# Altium schematic sheet MB_Control.SchDoc
size 420 x 297 mm; Date: 04/03/2023; ApprovedBy: UA3REO; CheckedBy: UA3REO; Author: RU4PN; CompanyName: Wolf Team; DocumentNumber: Wolf2 MainBoard Control; SheetNumber: 7; SheetTotal: 7
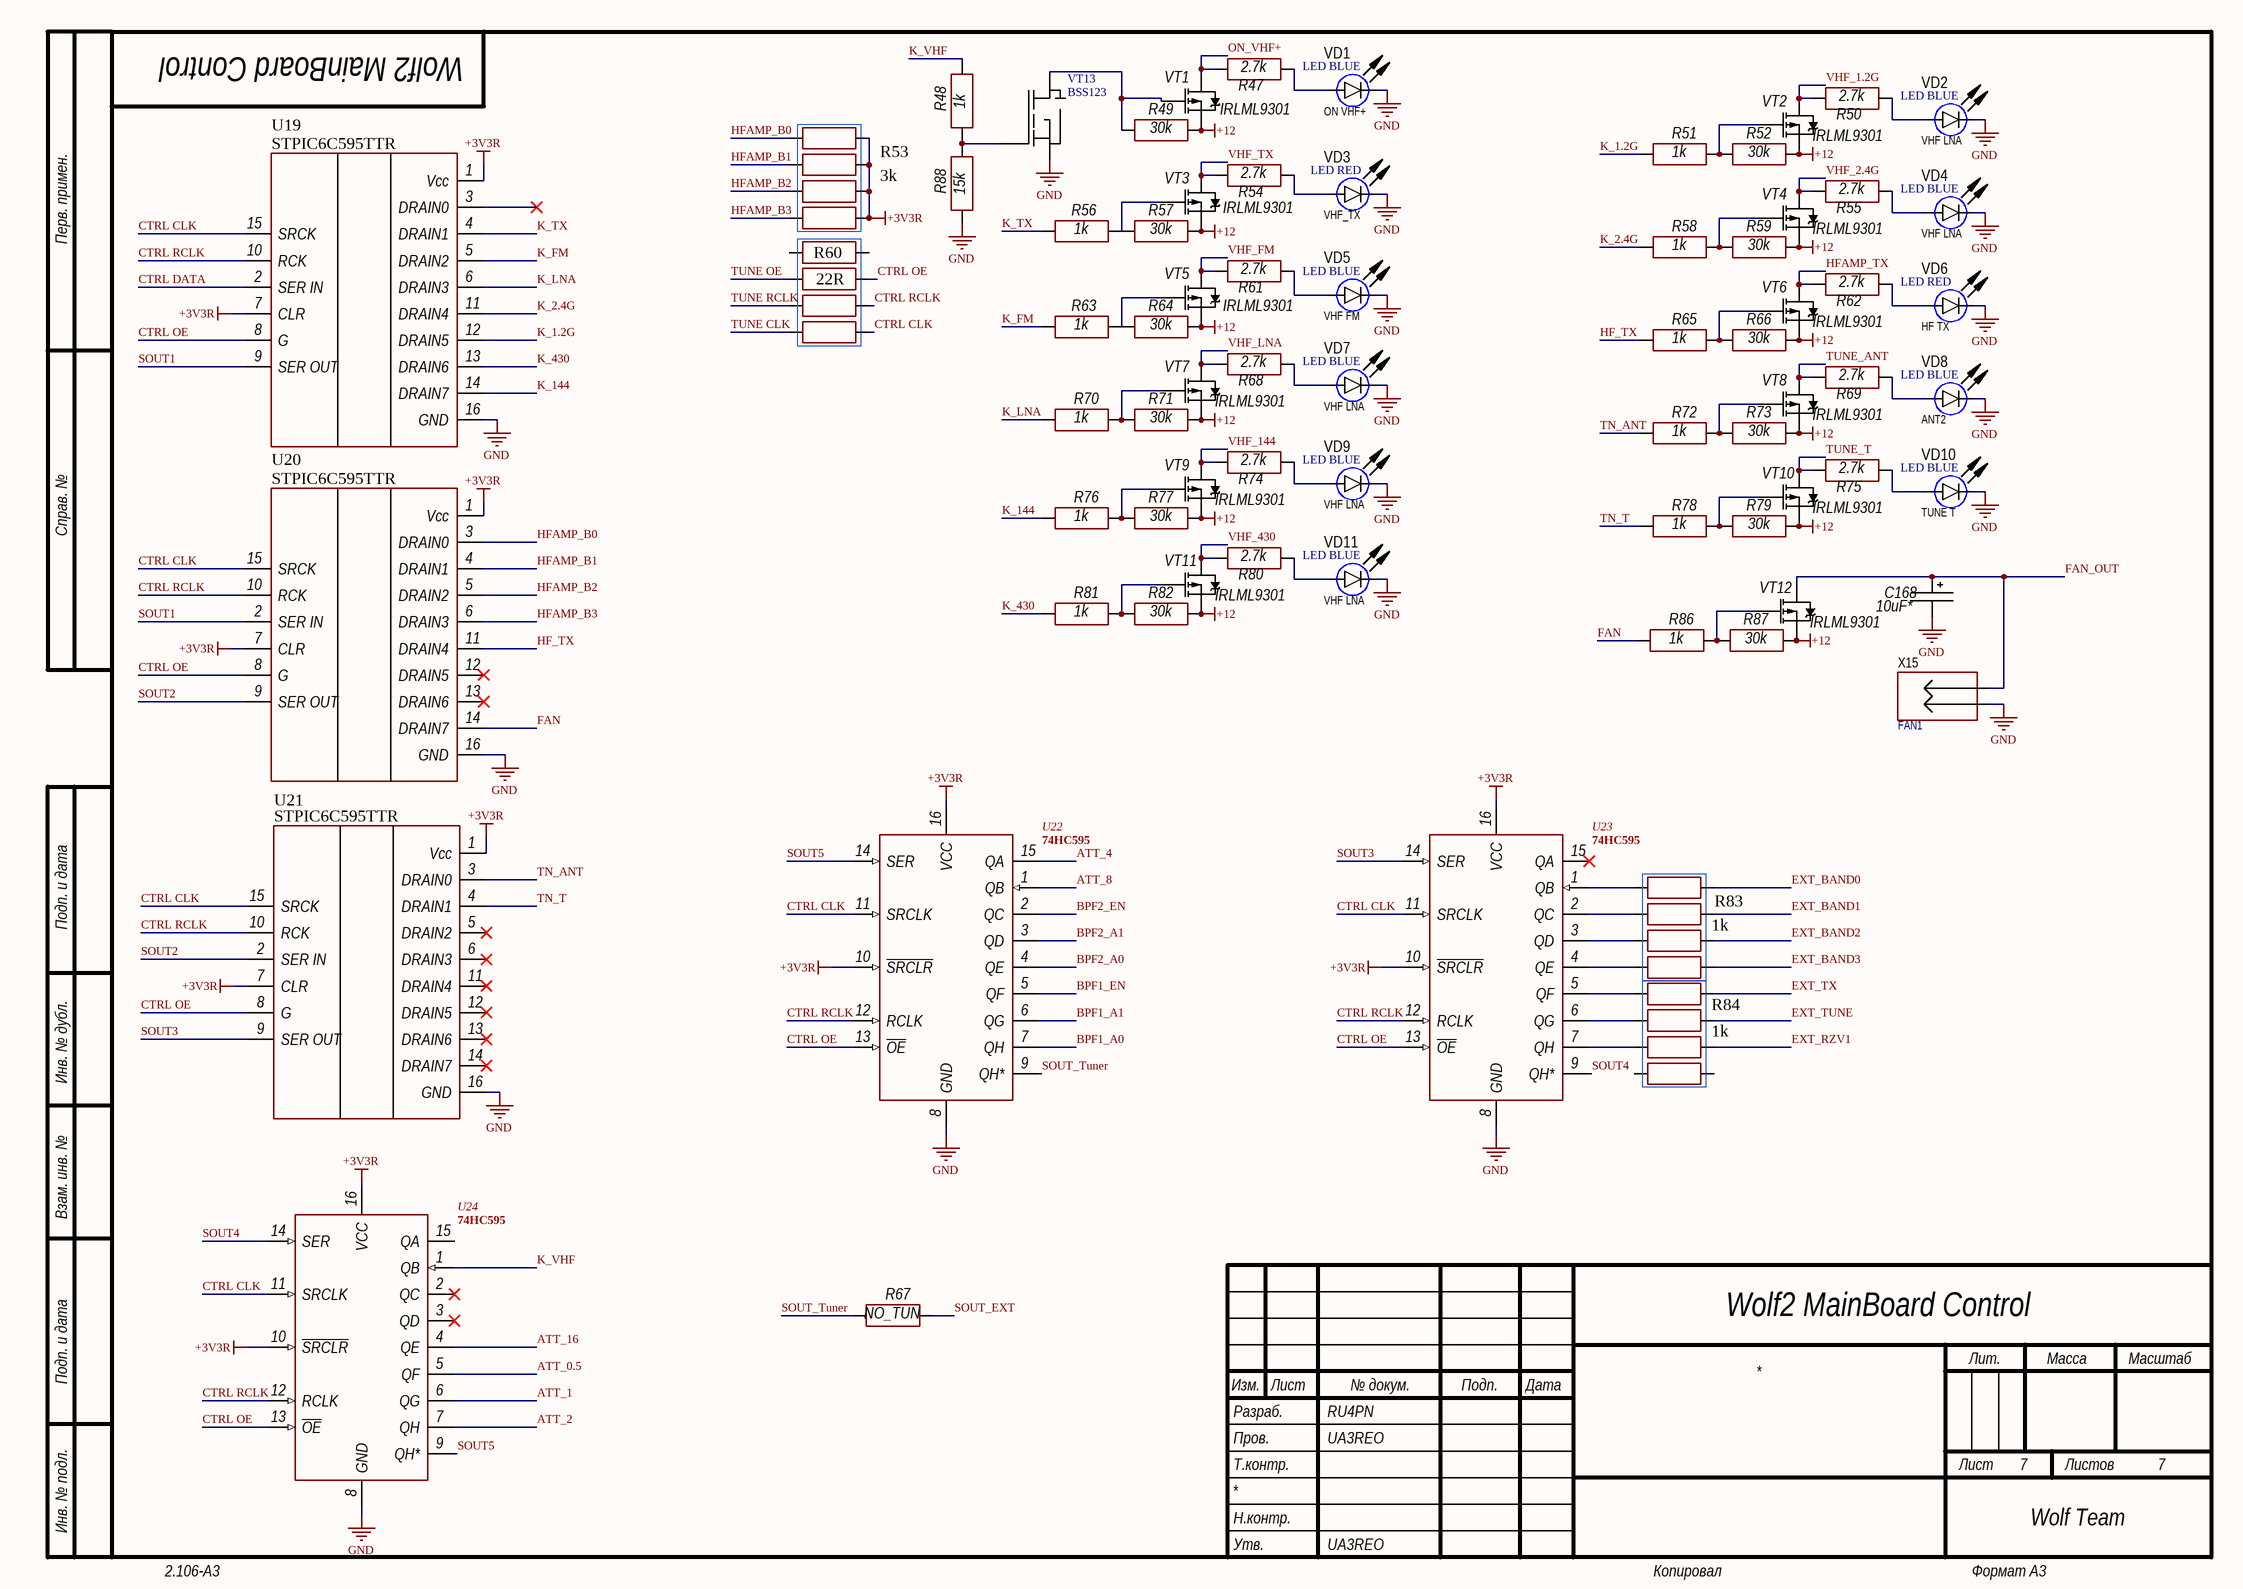
[diagram p0: MB_Control.SchDoc]

## Parts
C168  10uF*  [TANTAL_B]
R47  2.7k  [CH0805R]
R48  1k  [CH0805R]
R49  30k  [CH0805R]
R50  2.7k  [CH0805R]
R51  1k  [CH0805R]
R52  30k  [CH0805R]
R53  3k  [CAT16]
R54  2.7k  [CH0805R]
R55  2.7k  [CH0805R]
R56  1k  [CH0805R]
R57  30k  [CH0805R]
R58  1k  [CH0805R]
R59  30k  [CH0805R]
R60  22R  [CAT16]
R61  2.7k  [CH0805R]
R62  2.7k  [CH0805R]
R63  1k  [CH0805R]
R64  30k  [CH0805R]
R65  1k  [CH0805R]
R66  30k  [CH0805R]
R67  NO_TUN  [CH0805R]
R68  2.7k  [CH0805R]
R69  2.7k  [CH0805R]
R70  1k  [CH0805R]
R71  30k  [CH0805R]
R72  1k  [CH0805R]
R73  30k  [CH0805R]
R74  2.7k  [CH0805R]
R75  2.7k  [CH0805R]
R76  1k  [CH0805R]
R77  30k  [CH0805R]
R78  1k  [CH0805R]
R79  30k  [CH0805R]
R80  2.7k  [CH0805R]
R81  1k  [CH0805R]
R82  30k  [CH0805R]
R83  1k  [CAT16]
R84  1k  [CAT16]
R86  1k  [CH0805R]
R87  30k  [CH0805R]
R88  15k  [CH0805R]
U19  STPIC6C595TTR  [16-TSOP]
U20  STPIC6C595TTR  [16-TSOP]
U21  STPIC6C595TTR  [16-TSOP]
U22  74HC595  [16-SO]
U23  74HC595  [16-SO]
U24  74HC595  [16-SO]
VD1  LED BLUE  Color: ON VHF+  [LED: 0805B]
VD2  LED BLUE  Color: VHF LNA  [LED: 0805B]
VD3  LED RED  Color: VHF_TX  [LED: 0805R]
VD4  LED BLUE  Color: VHF LNA  [LED: 0805B]
VD5  LED BLUE  Color: VHF FM  [LED: 0805B]
VD6  LED RED  Color: HF TX  [LED: 0805R]
VD7  LED BLUE  Color: VHF LNA  [LED: 0805B]
VD8  LED BLUE  Color: ANT2  [LED: 0805B]
VD9  LED BLUE  Color: VHF LNA  [LED: 0805B]
VD10  LED BLUE  Color: TUNE T  [LED: 0805B]
VD11  LED BLUE  Color: VHF LNA  [LED: 0805B]
VT1  IRLML9301  [SOT23_132]
VT2  IRLML9301  [SOT23_132]
VT3  IRLML9301  [SOT23_132]
VT4  IRLML9301  [SOT23_132]
VT5  IRLML9301  [SOT23_132]
VT6  IRLML9301  [SOT23_132]
VT7  IRLML9301  [SOT23_132]
VT8  IRLML9301  [SOT23_132]
VT9  IRLML9301  [SOT23_132]
VT10  IRLML9301  [SOT23_132]
VT11  IRLML9301  [SOT23_132]
VT12  IRLML9301  [SOT23_132]
VT13  BSS123  [SOT23_132]
X15  FAN1  [CON: CWF-2]

## Nets
+3V3R: R53.5 R53.6 R53.7 R53.8 U19.1(Vcc) U19.7(CLR) U20.1(Vcc) U20.7(CLR) U21.1(Vcc) U21.7(CLR) U22.10(~{SRCLR}) U22.16(VCC) U23.10(~{SRCLR}) U23.16(VCC) U24.10(~{SRCLR}) U24.16(VCC)
+12: R49.1 R52.1 R57.1 R59.1 R64.1 R66.1 R71.1 R73.1 R77.1 R79.1 R82.1 R87.1 VT1.2(S) VT2.2(S) VT3.2(S) VT4.2(S) VT5.2(S) VT6.2(S) VT7.2(S) VT8.2(S) VT9.2(S) VT10.2(S) VT11.2(S) VT12.2(S)
GND: C168.2 R88.2 U19.16(GND) U20.16(GND) U21.16(GND) U22.8(GND) U23.8(GND) U24.8(GND) VD1.2(C) VD2.2(C) VD3.2(C) VD4.2(C) VD5.2(C) VD6.2(C) VD7.2(C) VD8.2(C) VD9.2(C) VD10.2(C) VD11.2(C) VT13.2(S) X15.2
ATT_0.5: U24.5(QF)
ATT_1: U24.6(QG)
ATT_2: U24.7(QH)
ATT_4: U22.15(QA)
ATT_8: U22.1(QB)
ATT_16: U24.4(QE)
BPF1_A0: U22.7(QH)
BPF1_A1: U22.6(QG)
BPF1_EN: U22.5(QF)
BPF2_A0: U22.4(QE)
BPF2_A1: U22.3(QD)
BPF2_EN: U22.2(QC)
CTRL CLK: R60.8 U19.15(SRCK) U20.15(SRCK) U21.15(SRCK) U22.11(SRCLK) U23.11(SRCLK) U24.11(SRCLK)
CTRL DATA: U19.2(SER_IN)
CTRL OE: R60.6 U19.8(G) U20.8(G) U21.8(G) U22.13(~{OE}) U23.13(~{OE}) U24.13(~{OE})
CTRL RCLK: R60.7 U19.10(RCK) U20.10(RCK) U21.10(RCK) U22.12(RCLK) U23.12(RCLK) U24.12(RCLK)
EXT_BAND0: R83.5
EXT_BAND1: R83.6
EXT_BAND2: R83.7
EXT_BAND3: R83.8
EXT_RZV1: R84.7
EXT_TUNE: R84.6
EXT_TX: R84.5
FAN: R86.2 U20.14(DRAIN7)
FAN_OUT: C168.1 VT12.3(D) X15.1
HF_TX: R65.2 U20.11(DRAIN4)
HFAMP_B0: R53.1 U20.3(DRAIN0)
HFAMP_B1: R53.2 U20.4(DRAIN1)
HFAMP_B2: R53.3 U20.5(DRAIN2)
HFAMP_B3: R53.4 U20.6(DRAIN3)
HFAMP_TX: R62.2 VT6.3(D)
K_1.2G: R51.2 U19.12(DRAIN5)
K_2.4G: R58.2 U19.11(DRAIN4)
K_144: R76.2 U19.14(DRAIN7)
K_430: R81.2 U19.13(DRAIN6)
K_FM: R63.2 U19.5(DRAIN2)
K_LNA: R70.2 U19.6(DRAIN3)
K_TX: R56.2 U19.4(DRAIN1)
K_VHF: R48.1 U24.1(QB)
ON_VHF+: R47.2 VT1.3(D)
SOUT1: U19.9(SER_OUT) U20.2(SER_IN)
SOUT2: U20.9(SER_OUT) U21.2(SER_IN)
SOUT3: U21.9(SER_OUT) U23.14(SER)
SOUT4: U23.9(QH*) U24.14(SER)
SOUT5: U22.14(SER) U24.9(QH*)
SOUT_EXT: R67.1
SOUT_Tuner: R67.2 U22.9(QH*)
TN_ANT: R72.2 U21.3(DRAIN0)
TN_T: R78.2 U21.4(DRAIN1)
TUNE CLK: R60.4
TUNE OE: R60.2
TUNE RCLK: R60.3
TUNE_ANT: R69.2 VT8.3(D)
TUNE_T: R75.2 VT10.3(D)
VHF_1.2G: R50.2 VT2.3(D)
VHF_2.4G: R55.2 VT4.3(D)
VHF_144: R74.2 VT9.3(D)
VHF_430: R80.2 VT11.3(D)
VHF_FM: R61.2 VT5.3(D)
VHF_LNA: R68.2 VT7.3(D)
VHF_TX: R54.2 VT3.3(D)
NetR47_1: R47.1 VD1.1(A)
NetR48_2: R48.2 R88.1 VT13.1(G)
NetR49_2: R49.2 VT1.1(G) VT13.3(D)
NetR50_1: R50.1 VD2.1(A)
NetR51_1: R51.1 R52.2 VT2.1(G)
NetR54_1: R54.1 VD3.1(A)
NetR55_1: R55.1 VD4.1(A)
NetR56_1: R56.1 R57.2 VT3.1(G)
NetR58_1: R58.1 R59.2 VT4.1(G)
NetR61_1: R61.1 VD5.1(A)
NetR62_1: R62.1 VD6.1(A)
NetR63_1: R63.1 R64.2 VT5.1(G)
NetR65_1: R65.1 R66.2 VT6.1(G)
NetR68_1: R68.1 VD7.1(A)
NetR69_1: R69.1 VD8.1(A)
NetR70_1: R70.1 R71.2 VT7.1(G)
NetR72_1: R72.1 R73.2 VT8.1(G)
NetR74_1: R74.1 VD9.1(A)
NetR75_1: R75.1 VD10.1(A)
NetR76_1: R76.1 R77.2 VT9.1(G)
NetR78_1: R78.1 R79.2 VT10.1(G)
NetR80_1: R80.1 VD11.1(A)
NetR81_1: R81.1 R82.2 VT11.1(G)
NetR83_1: R83.1 U23.1(QB)
NetR83_2: R83.2 U23.2(QC)
NetR83_3: R83.3 U23.3(QD)
NetR83_4: R83.4 U23.4(QE)
NetR84_1: R84.1 U23.5(QF)
NetR84_2: R84.2 U23.6(QG)
NetR84_3: R84.3 U23.7(QH)
NetR86_1: R86.1 R87.2 VT12.1(G)

Not connected (* = marked no-connect by the designer): R60 1 5; R84 4 8; U19 3(DRAIN0)*; U20 12(DRAIN5)* 13(DRAIN6)*; U21 5(DRAIN2)* 6(DRAIN3)* 11(DRAIN4)* 12(DRAIN5)* 13(DRAIN6)* 14(DRAIN7)*; U23 15(QA)*; U24 2(QC)* 3(QD)* 15(QA)

## Notes on the sheet
- Перв. примен.
- Справ. №
- Подп. и дата
- Инв. № дубл.
- Взам. инв. №
- Разраб.
- Изм.
- Лист
- № докум.
- Подп.
- Дата
- Лит.
- Масса
- Масштаб
- Пров.
- Т.контр.
- Листов
- Инв. № подл.
- Утв.
- Н.контр.
- 2.106-A3
- Копировал
- Формат А3

## Library data of the parts
C168 = TantalCap: Manufacturer: *; Model: *; HelpURL: *; ComponentKind: *; Value: *
R47-R52 R54-R59 R61-R82 R86-R88 = Resistor: Manufacturer: *; Model: *; HelpURL: *; ComponentKind: *; Value: *
R53 R60 R83 R84 = CAT10-0804
U22-U24 = HC595
VD1-VD11 = LED_single: ValueManufacturerPartNumber: LED, *, *, *, -55...+150°C; Manufacturer: *; Package: *; HelpURL: *; Temperature: -55...+150°C; TypeDiode: LED; Current: *; VoltageDrop: *; PartNumber: *
VT1-VT12 = IRLML9301: Mosfet; Model: *; Manufacturer: *; ComponentKind: *; HelpURL: *
X15 = Component-2pin